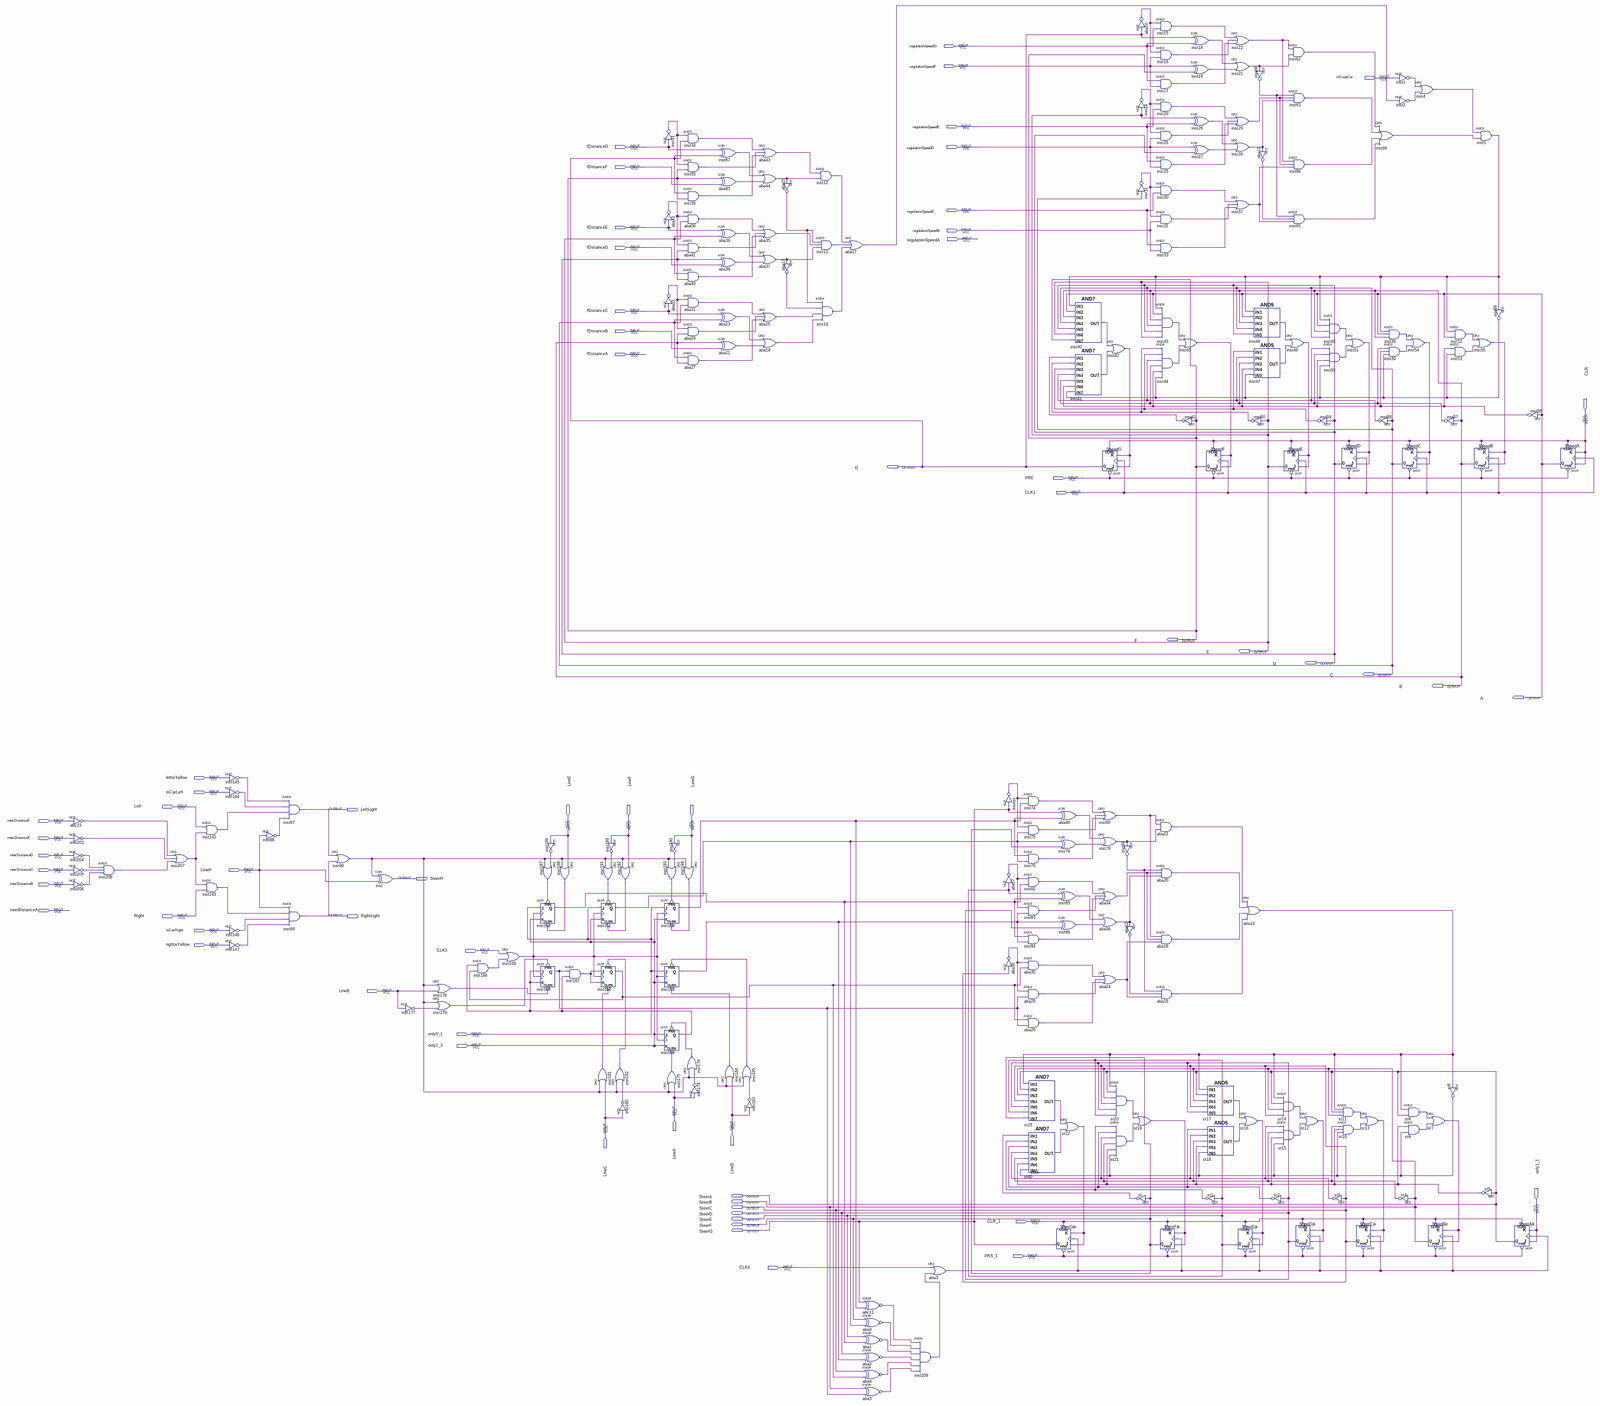
[diagram p0: schematic sheet, whole]
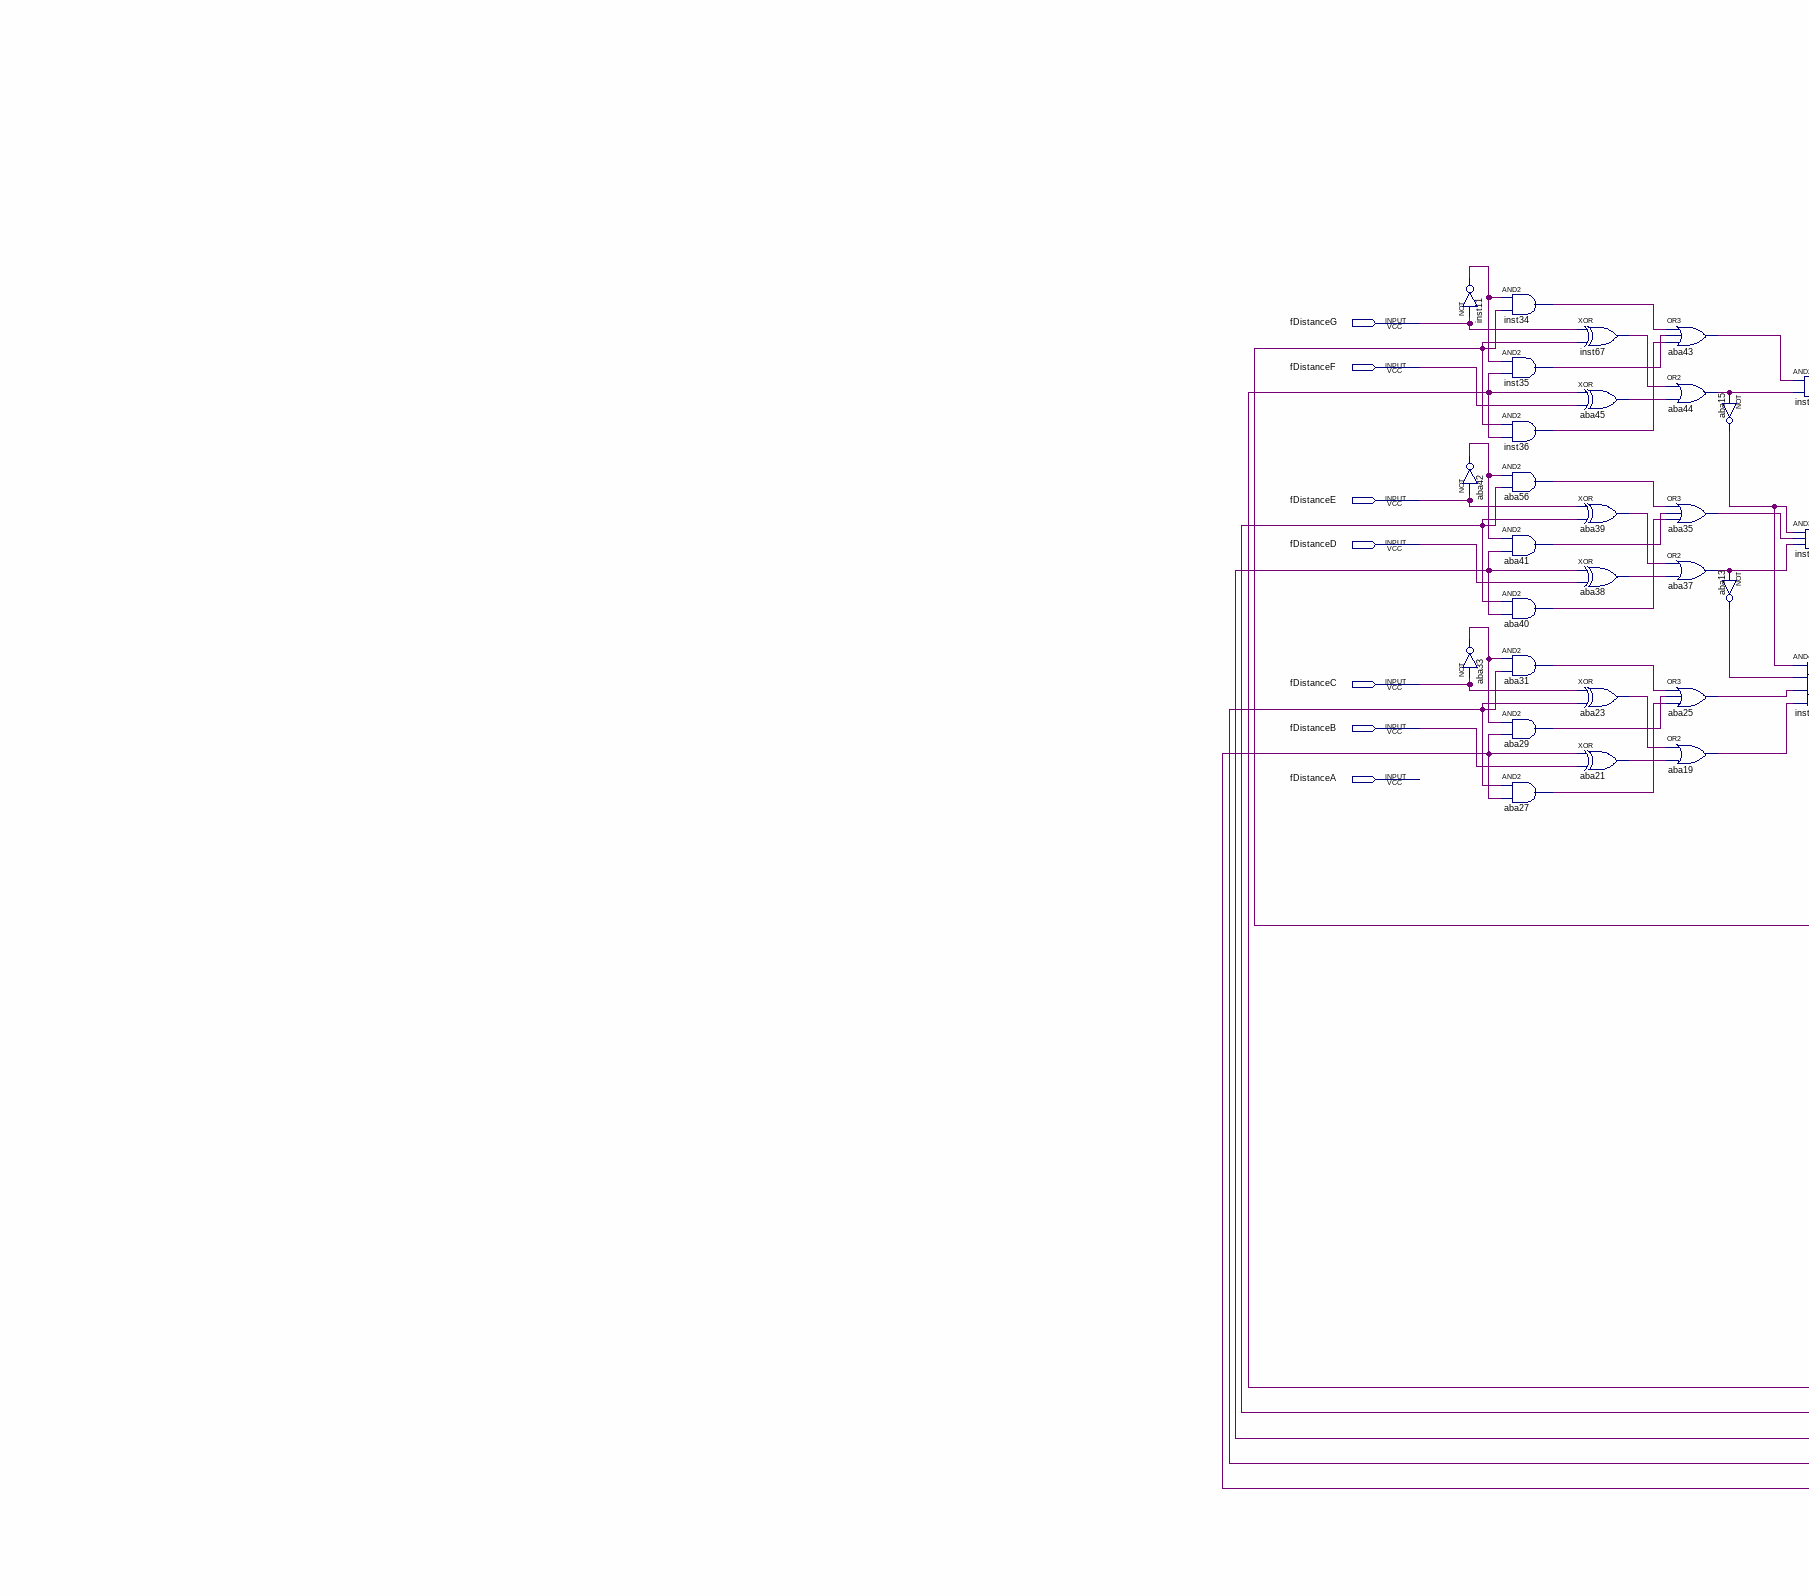
[diagram p1: schematic sheet, upper left part]
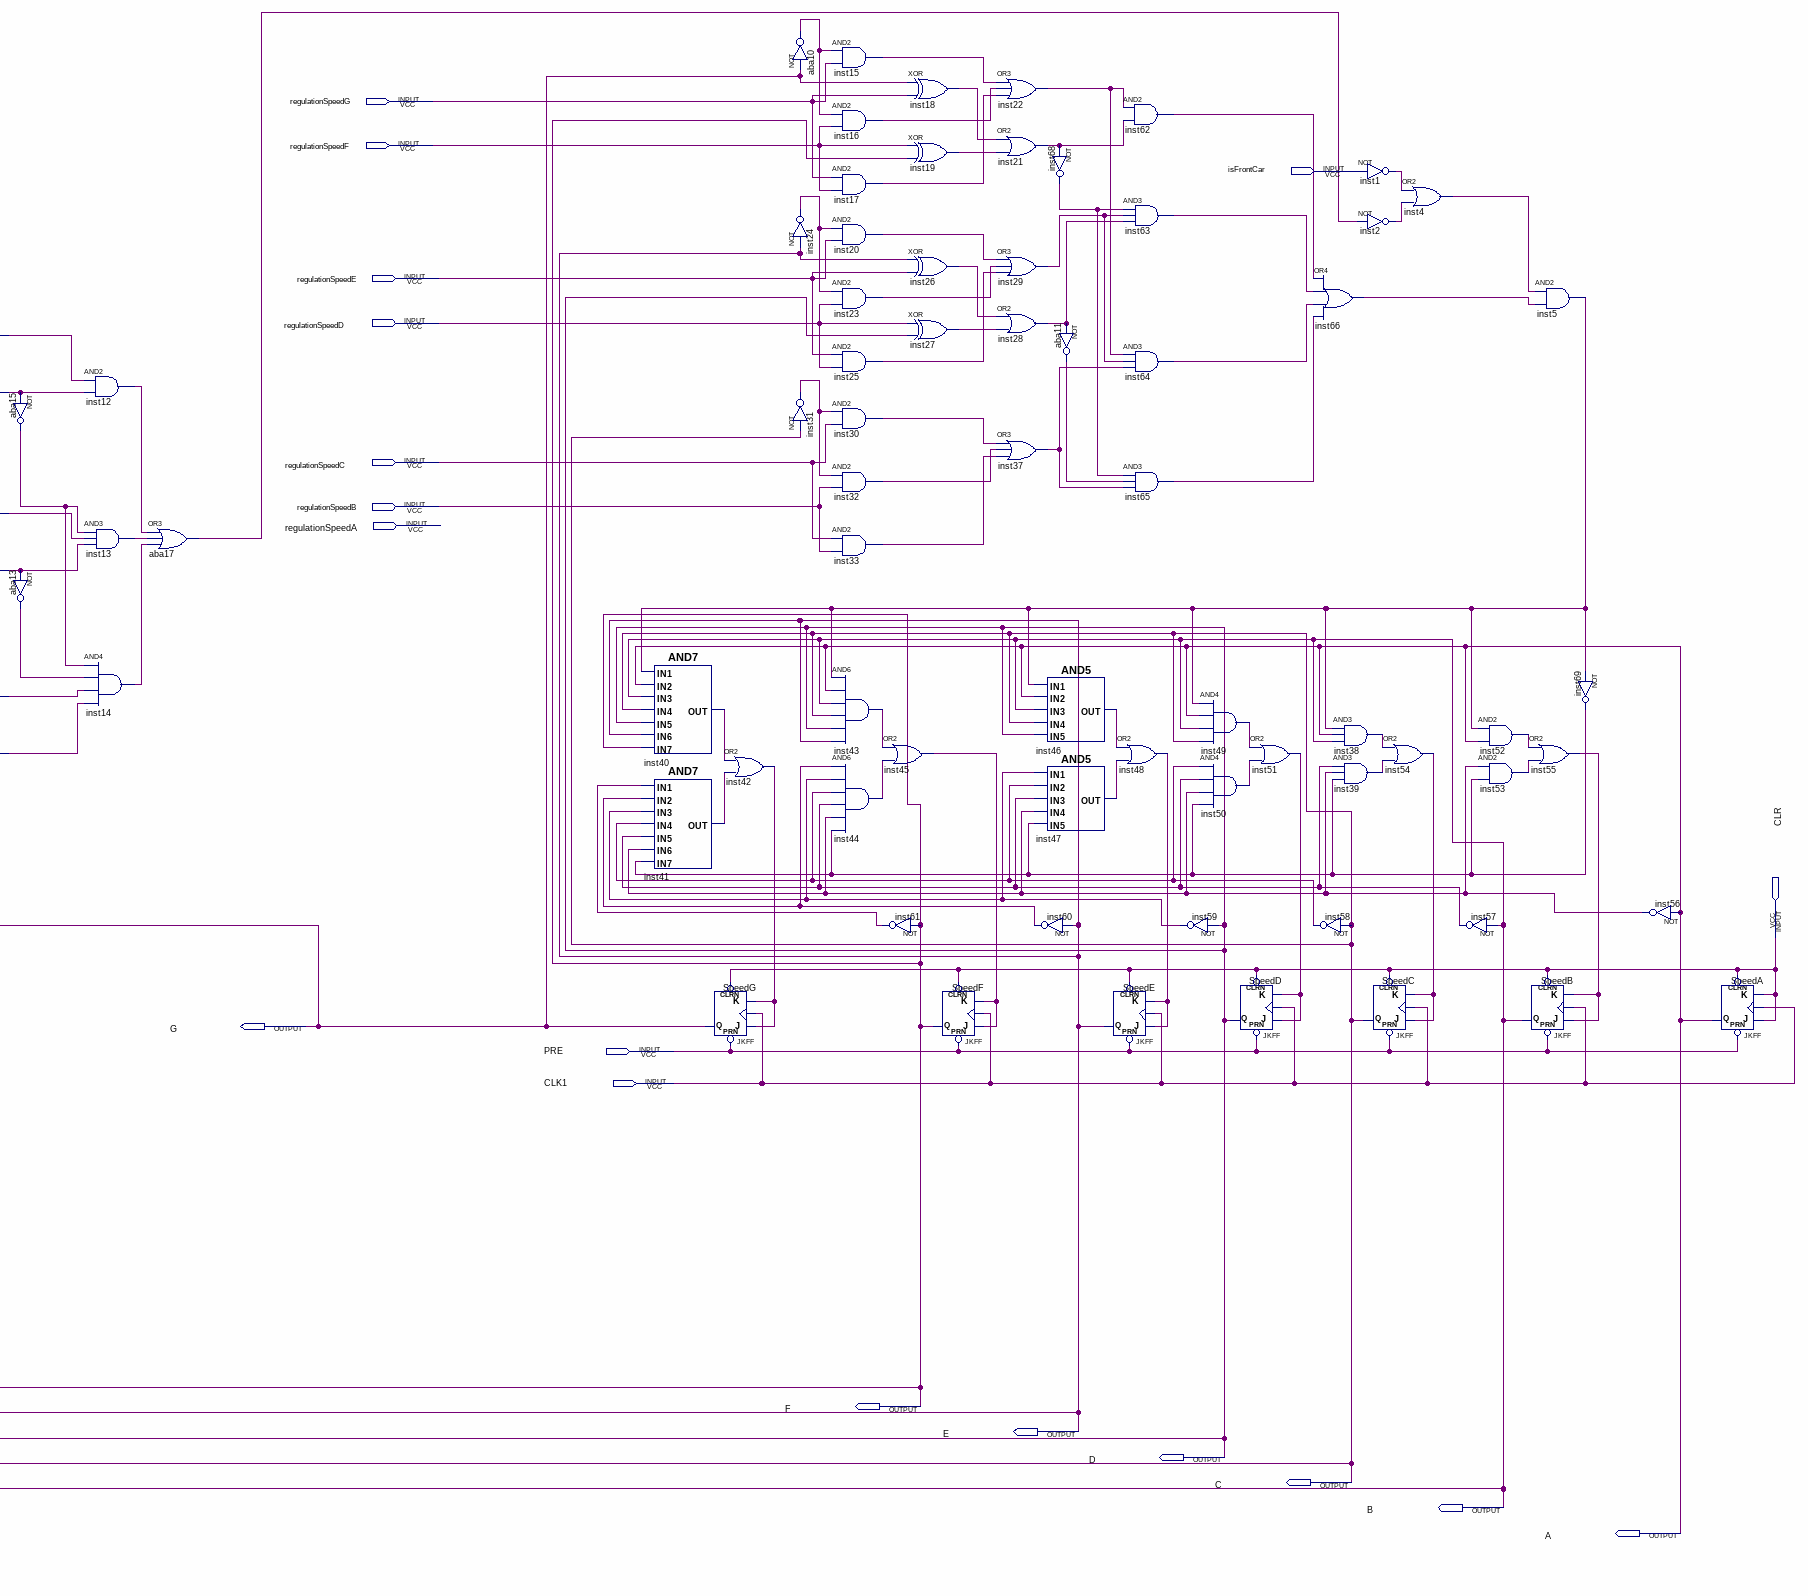
[diagram p2: schematic sheet, upper right part]
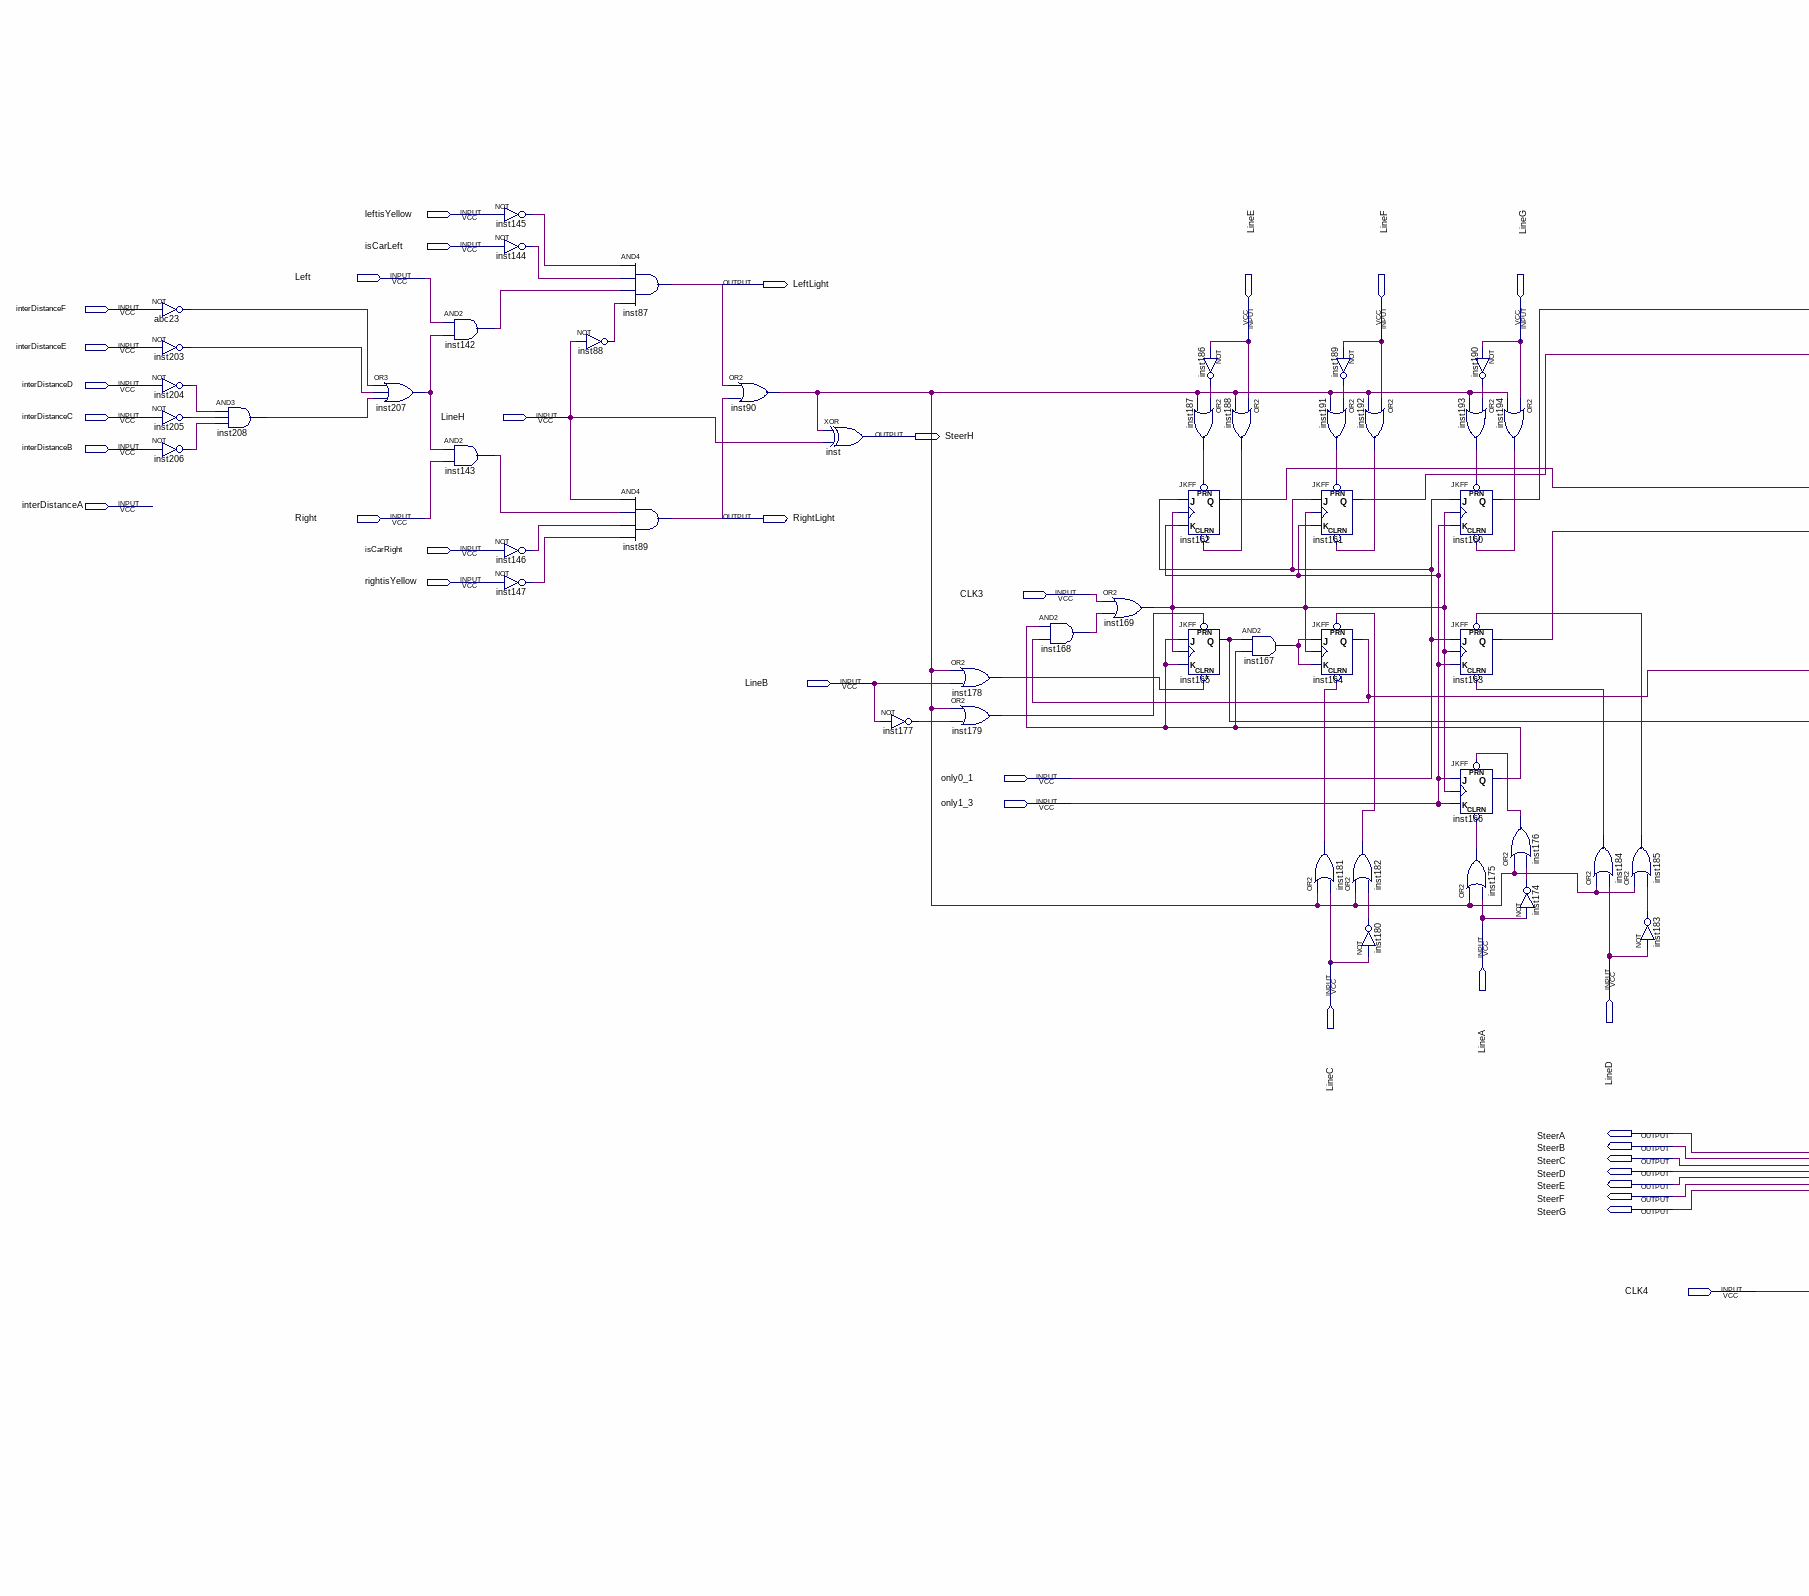
[diagram p3: schematic sheet, lower left part]
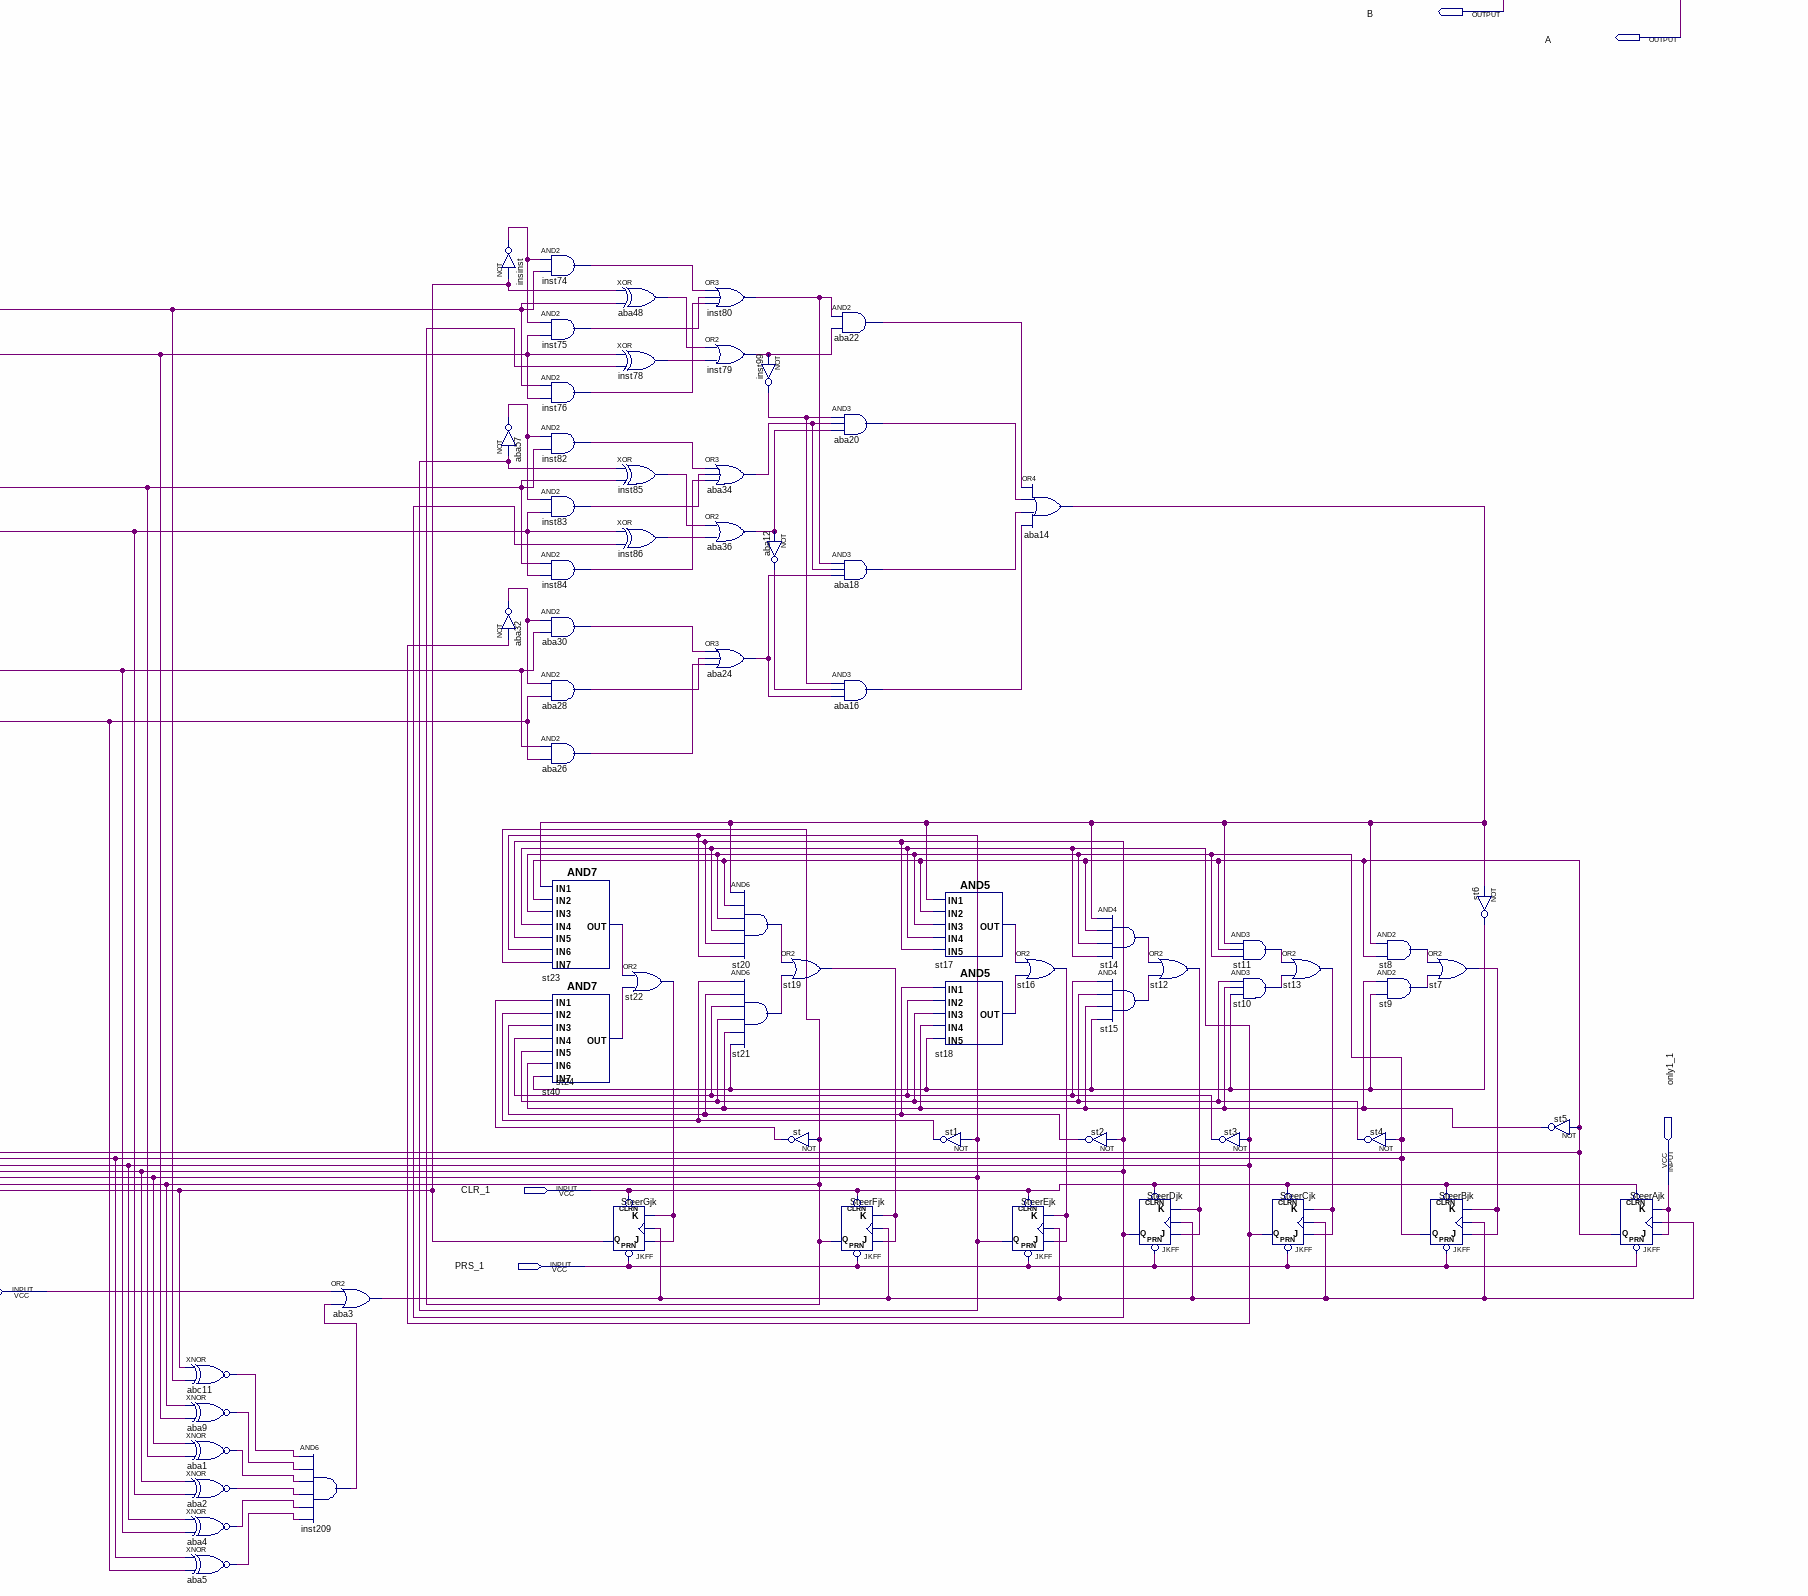
[diagram p4: schematic sheet, lower right part]
// Quartus schematic AutonomousCar.bdf as structural Verilog: 211 symbols, 62 pins
module AutonomousCar (
  input  regulationSpeedG,
  input  regulationSpeedF,
  input  isFrontCar,
  input  regulationSpeedE,
  input  fDistanceG,
  input  regulationSpeedD,
  input  fDistanceF,
  input  regulationSpeedC,
  input  fDistanceE,
  input  regulationSpeedB,
  input  regulationSpeedA,
  input  fDistanceD,
  input  fDistanceC,
  input  fDistanceB,
  input  fDistanceA,
  input  CLR,
  input  PRE,
  input  CLK1,
  input  leftisYellow,
  input  isCarLeft,
  input  Left,
  input  interDistanceF,
  input  LineE,
  input  LineF,
  input  LineG,
  input  interDistanceE,
  input  interDistanceD,
  input  interDistanceC,
  input  LineH,
  input  interDistanceB,
  input  interDistanceA,
  input  Right,
  input  isCarRight,
  input  rightisYellow,
  input  CLK3,
  input  LineB,
  input  only0_1,
  input  only1_3,
  input  LineA,
  input  LineD,
  input  LineC,
  input  only1_1,
  input  CLR_1,
  input  PRS_1,
  input  CLK4,
  output G,
  output F,
  output E,
  output D,
  output C,
  output B,
  output A,
  output LeftLight,
  output SteerH,
  output RightLight,
  output SteerA,
  output SteerB,
  output SteerC,
  output SteerD,
  output SteerE,
  output SteerF,
  output SteerG
);

  wire aba1_out, aba2_out, aba3_out, aba4_out, aba5_out, aba9_out, aba10_out, aba11_out, aba12_out,
       aba13_out, aba14_out, aba15_out, aba16_out, aba17_out, aba18_out, aba19_out, aba20_out, aba21_out,
       aba22_out, aba23_out, aba24_out, aba25_out, aba26_out, aba27_out, aba28_out, aba29_out, aba30_out,
       aba31_out, aba32_out, aba33_out, aba34_out, aba35_out, aba36_out, aba37_out, aba38_out, aba39_out,
       aba40_out, aba41_out, aba42_out, aba43_out, aba44_out, aba45_out, aba48_out, aba56_out, aba57_out,
       abc11_out, abc23_out, insinst_out, inst1_out, inst2_out, inst4_out, inst5_out, inst11_out, inst12_out,
       inst13_out, inst14_out, inst15_out, inst16_out, inst17_out, inst18_out, inst19_out, inst20_out,
       inst21_out, inst22_out, inst23_out, inst24_out, inst25_out, inst26_out, inst27_out, inst28_out,
       inst29_out, inst30_out, inst31_out, inst32_out, inst33_out, inst34_out, inst35_out, inst36_out,
       inst37_out, inst38_out, inst39_out, inst40_out, inst41_out, inst42_out, inst43_out, inst44_out,
       inst45_out, inst46_out, inst47_out, inst48_out, inst49_out, inst50_out, inst51_out, inst52_out,
       inst53_out, inst54_out, inst55_out, inst56_out, inst57_out, inst58_out, inst59_out, inst60_out,
       inst61_out, inst62_out, inst63_out, inst64_out, inst65_out, inst66_out, inst67_out, inst68_out,
       inst69_out, inst74_out, inst75_out, inst76_out, inst78_out, inst79_out, inst80_out, inst82_out,
       inst83_out, inst84_out, inst85_out, inst86_out, inst88_out, inst90_out, inst99_out, inst142_out,
       inst143_out, inst144_out, inst145_out, inst146_out, inst147_out, inst160_q, inst161_q, inst162_q,
       inst163_q, inst164_q, inst165_q, inst166_q, inst167_out, inst168_out, inst169_out, inst174_out,
       inst175_out, inst176_out, inst177_out, inst178_out, inst179_out, inst180_out, inst181_out,
       inst182_out, inst183_out, inst184_out, inst185_out, inst186_out, inst187_out, inst188_out,
       inst189_out, inst190_out, inst191_out, inst192_out, inst193_out, inst194_out, inst203_out,
       inst204_out, inst205_out, inst206_out, inst207_out, inst208_out, inst209_out, st1_out, st2_out,
       st3_out, st4_out, st5_out, st7_out, st8_out, st9_out, st10_out, st11_out, st12_out, st13_out,
       st14_out, st15_out, st16_out, st17_out, st18_out, st19_out, st20_out, st21_out, st22_out, st23_out,
       st24, st40_out, st_out;

  not abc23 (abc23_out, interDistanceF);
  not inst203 (inst203_out, interDistanceE);
  not inst204 (inst204_out, interDistanceD);
  not inst205 (inst205_out, interDistanceC);
  not inst206 (inst206_out, interDistanceB);
  and inst208 (inst208_out, inst204_out, inst205_out, inst206_out);
  or inst207 (inst207_out, abc23_out, inst203_out, inst208_out);
  and inst142 (inst142_out, Left, inst207_out);
  and inst143 (inst143_out, inst207_out, Right);
  not inst145 (inst145_out, leftisYellow);
  not inst144 (inst144_out, isCarLeft);
  not inst146 (inst146_out, isCarRight);
  not inst147 (inst147_out, rightisYellow);
  not inst88 (inst88_out, LineH);
  and inst87 (LeftLight, inst145_out, inst144_out, inst142_out, inst88_out);
  and inst89 (RightLight, LineH, inst143_out, inst146_out, inst147_out);
  or inst90 (inst90_out, LeftLight, RightLight);
  xor inst (SteerH, inst90_out, LineH);
  not inst177 (inst177_out, LineB);
  or inst178 (inst178_out, inst90_out, LineB);
  or inst179 (inst179_out, inst90_out, inst177_out);
  and inst168 (inst168_out, inst166_q, inst164_q);
  or inst169 (inst169_out, CLK3, inst168_out);
  not inst186 (inst186_out, LineE);
  or inst187 (inst187_out, inst186_out, inst90_out);
  JKFF inst162 (.PRN(inst187_out), .CLRN(inst188_out), .K(only1_3), .J(only0_1), .CLK(inst169_out), .Q(inst162_q));
  JKFF inst165 (.PRN(inst179_out), .CLRN(inst178_out), .K(inst166_q), .J(inst166_q), .CLK(inst169_out), .Q(inst165_q));
  or inst188 (inst188_out, LineE, inst90_out);
  and inst167 (inst167_out, inst165_q, inst166_q);
  JKFF inst161 (.PRN(inst191_out), .CLRN(inst192_out), .K(only1_3), .J(only0_1), .CLK(inst169_out), .Q(inst161_q));
  JKFF inst164 (
    .PRN(inst182_out), .CLRN(inst181_out), .K(inst167_out), .J(inst167_out), .CLK(inst169_out), .Q(inst164_q));
  or inst181 (inst181_out, inst90_out, LineC);
  not inst189 (inst189_out, LineF);
  or inst191 (inst191_out, inst189_out, inst90_out);
  or inst192 (inst192_out, LineF, inst90_out);
  or inst182 (inst182_out, inst90_out, inst180_out);
  not inst180 (inst180_out, LineC);
  not inst11 (inst11_out, fDistanceG);
  not aba42 (aba42_out, fDistanceE);
  not aba33 (aba33_out, fDistanceC);
  or inst193 (inst193_out, inst190_out, inst90_out);
  JKFF inst160 (.PRN(inst193_out), .CLRN(inst194_out), .K(only1_3), .J(only0_1), .CLK(inst169_out), .Q(inst160_q));
  JKFF inst163 (.PRN(inst185_out), .CLRN(inst184_out), .K(only1_3), .J(only0_1), .CLK(inst169_out), .Q(inst163_q));
  JKFF inst166 (.PRN(inst176_out), .CLRN(inst175_out), .K(only1_3), .J(only1_3), .CLK(inst169_out), .Q(inst166_q));
  or inst175 (inst175_out, inst90_out, LineA);
  and inst34 (inst34_out, inst11_out, G);
  and inst35 (inst35_out, inst11_out, F);
  and inst36 (inst36_out, G, F);
  and aba56 (aba56_out, aba42_out, E);
  and aba41 (aba41_out, aba42_out, D);
  and aba40 (aba40_out, E, D);
  and aba31 (aba31_out, aba33_out, C);
  and aba29 (aba29_out, aba33_out, B);
  and aba27 (aba27_out, C, B);
  not inst190 (inst190_out, LineG);
  or inst194 (inst194_out, LineG, inst90_out);
  or inst176 (inst176_out, inst90_out, inst174_out);
  not inst174 (inst174_out, LineA);
  xor inst67 (inst67_out, fDistanceG, G);
  xor aba45 (aba45_out, F, fDistanceF);
  xor aba39 (aba39_out, fDistanceE, E);
  xor aba38 (aba38_out, D, fDistanceD);
  xor aba23 (aba23_out, fDistanceC, C);
  xor aba21 (aba21_out, B, fDistanceB);
  or inst184 (inst184_out, inst90_out, LineD);
  or aba43 (aba43_out, inst34_out, inst35_out, inst36_out);
  or aba44 (aba44_out, inst67_out, aba45_out);
  or aba35 (aba35_out, aba56_out, aba41_out, aba40_out);
  or aba37 (aba37_out, aba39_out, aba38_out);
  or aba25 (aba25_out, aba31_out, aba29_out, aba27_out);
  or aba19 (aba19_out, aba23_out, aba21_out);
  or inst185 (inst185_out, inst90_out, inst183_out);
  not inst183 (inst183_out, LineD);
  not aba15 (aba15_out, aba44_out);
  not aba13 (aba13_out, aba37_out);
  and inst12 (inst12_out, aba43_out, aba44_out);
  and inst13 (inst13_out, aba15_out, aba35_out, aba37_out);
  and inst14 (inst14_out, aba15_out, aba13_out, aba25_out, aba19_out);
  or aba17 (aba17_out, inst12_out, inst13_out, inst14_out);
  xnor abc11 (abc11_out, SteerG, inst160_q);
  xnor aba9 (aba9_out, SteerF, inst161_q);
  xnor aba1 (aba1_out, SteerE, inst162_q);
  xnor aba2 (aba2_out, SteerD, inst163_q);
  xnor aba4 (aba4_out, SteerC, inst164_q);
  xnor aba5 (aba5_out, SteerB, inst165_q);
  and inst209 (inst209_out, abc11_out, aba9_out, aba1_out, aba2_out, aba4_out, aba5_out);
  or aba3 (aba3_out, CLK4, inst209_out);
  not insinst (insinst_out, SteerG);
  not aba57 (aba57_out, SteerE);
  not aba32 (aba32_out, SteerC);
  and inst74 (inst74_out, insinst_out, inst160_q);
  and inst75 (inst75_out, insinst_out, inst161_q);
  and inst76 (inst76_out, inst160_q, inst161_q);
  and inst82 (inst82_out, aba57_out, inst162_q);
  and inst83 (inst83_out, aba57_out, inst163_q);
  and inst84 (inst84_out, inst162_q, inst163_q);
  and aba30 (aba30_out, aba32_out, inst164_q);
  and aba28 (aba28_out, aba32_out, inst165_q);
  and aba26 (aba26_out, inst164_q, inst165_q);
  and st23 (st23_out, aba14_out, SteerA, SteerB, SteerC, SteerD, SteerE, SteerF);
  and st40 (st40_out, st_out, st1_out, st2_out, st3_out, st4_out, st5_out, st24);
  xor aba48 (aba48_out, SteerG, inst160_q);
  xor inst78 (inst78_out, inst161_q, SteerF);
  xor inst85 (inst85_out, SteerE, inst162_q);
  xor inst86 (inst86_out, inst163_q, SteerD);
  JKFF SteerGjk (.PRN(PRS_1), .CLRN(CLR_1), .K(st22_out), .J(st22_out), .CLK(aba3_out), .Q(SteerG));
  and inst40 (inst40_out, inst5_out, A, B, C, D, E, F);
  and inst41 (inst41_out, inst61_out, inst60_out, inst59_out, inst58_out, inst57_out, inst56_out, inst69_out);
  or st22 (st22_out, st23_out, st40_out);
  JKFF SpeedG (.PRN(PRE), .CLRN(CLR), .K(inst42_out), .J(inst42_out), .CLK(CLK1), .Q(G));
  or inst80 (inst80_out, inst74_out, inst75_out, inst76_out);
  or inst79 (inst79_out, aba48_out, inst78_out);
  or aba34 (aba34_out, inst82_out, inst83_out, inst84_out);
  or aba36 (aba36_out, inst85_out, inst86_out);
  or aba24 (aba24_out, aba30_out, aba28_out, aba26_out);
  or inst42 (inst42_out, inst40_out, inst41_out);
  not inst99 (inst99_out, inst79_out);
  not aba12 (aba12_out, aba36_out);
  and st20 (st20_out, aba14_out, SteerA, SteerB, SteerC, SteerD, SteerE);
  and st21 (st21_out, st1_out, st2_out, st3_out, st4_out, st5_out, st24);
  not aba10 (aba10_out, G);
  not inst24 (inst24_out, E);
  not inst31 (inst31_out, C);
  or st19 (st19_out, st20_out, st21_out);
  not st (st_out, SteerF);
  and inst15 (inst15_out, aba10_out, regulationSpeedG);
  and inst16 (inst16_out, aba10_out, regulationSpeedF);
  and inst17 (inst17_out, regulationSpeedG, regulationSpeedF);
  and inst20 (inst20_out, inst24_out, regulationSpeedE);
  and inst23 (inst23_out, inst24_out, regulationSpeedD);
  and inst25 (inst25_out, regulationSpeedE, regulationSpeedD);
  and inst30 (inst30_out, inst31_out, regulationSpeedC);
  and inst32 (inst32_out, inst31_out, regulationSpeedB);
  and inst33 (inst33_out, regulationSpeedC, regulationSpeedB);
  and inst43 (inst43_out, inst5_out, A, B, C, D, E);
  and inst44 (inst44_out, inst60_out, inst59_out, inst58_out, inst57_out, inst56_out, inst69_out);
  and aba22 (aba22_out, inst80_out, inst79_out);
  and aba20 (aba20_out, inst99_out, aba34_out, aba36_out);
  and aba18 (aba18_out, inst80_out, aba34_out, aba24_out);
  and aba16 (aba16_out, inst99_out, aba12_out, aba24_out);
  JKFF SteerFjk (.PRN(PRS_1), .CLRN(CLR_1), .K(st19_out), .J(st19_out), .CLK(aba3_out), .Q(SteerF));
  xor inst18 (inst18_out, G, regulationSpeedG);
  xor inst19 (inst19_out, regulationSpeedF, F);
  xor inst26 (inst26_out, E, regulationSpeedE);
  xor inst27 (inst27_out, regulationSpeedD, D);
  or inst45 (inst45_out, inst43_out, inst44_out);
  not inst61 (inst61_out, F);
  JKFF SpeedF (.PRN(PRE), .CLRN(CLR), .K(inst45_out), .J(inst45_out), .CLK(CLK1), .Q(F));
  and st17 (st17_out, aba14_out, SteerA, SteerB, SteerC, SteerD);
  and st18 (st18_out, st2_out, st3_out, st4_out, st5_out, st24);
  not st1 (st1_out, SteerE);
  or inst22 (inst22_out, inst15_out, inst16_out, inst17_out);
  or inst21 (inst21_out, inst18_out, inst19_out);
  or inst29 (inst29_out, inst20_out, inst23_out, inst25_out);
  or inst28 (inst28_out, inst26_out, inst27_out);
  or inst37 (inst37_out, inst30_out, inst32_out, inst33_out);
  or aba14 (aba14_out, aba22_out, aba20_out, aba18_out, aba16_out);
  or st16 (st16_out, st17_out, st18_out);
  JKFF SteerEjk (.PRN(PRS_1), .CLRN(CLR_1), .K(st16_out), .J(st16_out), .CLK(aba3_out), .Q(SteerE));
  not inst68 (inst68_out, inst21_out);
  not aba11 (aba11_out, inst28_out);
  and inst46 (inst46_out, inst5_out, A, B, C, D);
  and inst47 (inst47_out, inst59_out, inst58_out, inst57_out, inst56_out, inst69_out);
  not inst60 (inst60_out, E);
  and inst62 (inst62_out, inst22_out, inst21_out);
  and inst63 (inst63_out, inst68_out, inst29_out, inst28_out);
  and inst64 (inst64_out, inst22_out, inst29_out, inst37_out);
  and inst65 (inst65_out, inst68_out, aba11_out, inst37_out);
  or inst48 (inst48_out, inst46_out, inst47_out);
  JKFF SpeedE (.PRN(PRE), .CLRN(CLR), .K(inst48_out), .J(inst48_out), .CLK(CLK1), .Q(E));
  and st14 (st14_out, aba14_out, SteerA, SteerB, SteerC);
  and st15 (st15_out, st3_out, st4_out, st5_out, st24);
  not st2 (st2_out, SteerD);
  or st12 (st12_out, st14_out, st15_out);
  JKFF SteerDjk (.PRN(PRS_1), .CLRN(CLR_1), .K(st12_out), .J(st12_out), .CLK(aba3_out), .Q(SteerD));
  and inst49 (inst49_out, inst5_out, A, B, C);
  and inst50 (inst50_out, inst58_out, inst57_out, inst56_out, inst69_out);
  not inst59 (inst59_out, D);
  not st3 (st3_out, SteerC);
  or inst51 (inst51_out, inst49_out, inst50_out);
  JKFF SpeedD (.PRN(PRE), .CLRN(CLR), .K(inst51_out), .J(inst51_out), .CLK(CLK1), .Q(D));
  and st11 (st11_out, aba14_out, SteerA, SteerB);
  and st10 (st10_out, st4_out, st5_out, st24);
  JKFF SteerCjk (.PRN(PRS_1), .CLRN(CLR_1), .K(st13_out), .J(st13_out), .CLK(aba3_out), .Q(SteerC));
  or inst66 (inst66_out, inst62_out, inst63_out, inst64_out, inst65_out);
  not inst58 (inst58_out, C);
  or st13 (st13_out, st11_out, st10_out);
  not inst1 (inst1_out, isFrontCar);
  not inst2 (inst2_out, aba17_out);
  and inst38 (inst38_out, inst5_out, A, B);
  and inst39 (inst39_out, inst57_out, inst56_out, inst69_out);
  JKFF SpeedC (.PRN(PRE), .CLRN(CLR), .K(inst54_out), .J(inst54_out), .CLK(CLK1), .Q(C));
  and st8 (st8_out, aba14_out, SteerA);
  and st9 (st9_out, st5_out, st24);
  not st4 (st4_out, SteerB);
  or inst4 (inst4_out, inst1_out, inst2_out);
  or inst54 (inst54_out, inst38_out, inst39_out);
  or st7 (st7_out, st8_out, st9_out);
  JKFF SteerBjk (.PRN(PRS_1), .CLRN(CLR_1), .K(st7_out), .J(st7_out), .CLK(aba3_out), .Q(SteerB));
  and inst52 (inst52_out, inst5_out, A);
  and inst53 (inst53_out, inst56_out, inst69_out);
  not inst57 (inst57_out, B);
  not st6 (st24, aba14_out);
  or inst55 (inst55_out, inst52_out, inst53_out);
  JKFF SpeedB (.PRN(PRE), .CLRN(CLR), .K(inst55_out), .J(inst55_out), .CLK(CLK1), .Q(B));
  and inst5 (inst5_out, inst4_out, inst66_out);
  not inst69 (inst69_out, inst5_out);
  not st5 (st5_out, SteerA);
  JKFF SteerAjk (.PRN(PRS_1), .CLRN(CLR_1), .K(only1_1), .J(only1_1), .CLK(aba3_out), .Q(SteerA));
  not inst56 (inst56_out, A);
  JKFF SpeedA (.PRN(PRE), .CLRN(CLR), .K(CLR), .J(CLR), .CLK(CLK1), .Q(A));
endmodule
